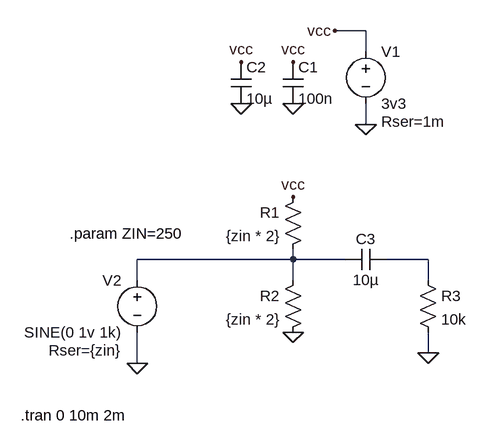
[diagram p0: schematic adc_sampling_ac_signal.asc]
adc_sampling_ac_signal.asc, the LTspice schematic file:
Version 4
SHEET 1 880 680
WIRE 288 64 240 64
WIRE 288 96 288 64
WIRE 288 208 288 176
WIRE 176 416 176 400
WIRE 176 416 -64 416
WIRE 256 416 176 416
WIRE 384 416 320 416
WIRE -64 448 -64 416
WIRE 176 448 176 416
WIRE 384 448 384 416
WIRE 384 560 384 528
WIRE -64 576 -64 528
FLAG 288 208 0
FLAG 240 64 vcc
FLAG 176 176 0
FLAG 96 176 0
FLAG 176 112 vcc
FLAG 96 112 vcc
FLAG 384 560 0
FLAG 176 320 vcc
FLAG 176 528 0
FLAG -64 576 0
SYMBOL voltage 288 80 R0
WINDOW 123 0 0 Left 0
WINDOW 39 24 124 Left 2
SYMATTR InstName V1
SYMATTR Value 3v3
SYMATTR SpiceLine Rser=1m
SYMBOL cap 160 112 R0
SYMATTR InstName C1
SYMATTR Value 100n
SYMBOL cap 80 112 R0
SYMATTR InstName C2
SYMATTR Value 10µ
SYMBOL res 192 304 M0
SYMATTR InstName R1
SYMATTR Value {zin * 2}
SYMBOL cap 320 400 R90
WINDOW 0 0 32 VBottom 2
WINDOW 3 32 32 VTop 2
SYMATTR InstName C3
SYMATTR Value 10µ
SYMBOL res 368 432 R0
SYMATTR InstName R3
SYMATTR Value 10k
SYMBOL res 192 432 M0
SYMATTR InstName R2
SYMATTR Value {zin * 2}
SYMBOL voltage -64 432 M0
WINDOW 123 0 0 Left 0
WINDOW 39 24 124 Left 2
SYMATTR InstName V2
SYMATTR Value SINE(0 1v 1k)
SYMATTR SpiceLine Rser={zin}
TEXT -168 376 Left 2 !.param ZIN=250
TEXT -80 656 Right 2 !.tran 0 10m 2m

The netlist it stands for:
* adc_sampling_ac_signal.asc
V1 vcc 0 3v3 Rser=1m
C1 vcc 0 100n
C2 vcc 0 10µ
R1 vcc N001 {zin * 2}
C3 N002 N001 10µ
R3 N002 0 10k
R2 N001 0 {zin * 2}
V2 N001 0 SINE(0 1v 1k) Rser={zin}
.param ZIN=250
.tran 0 10m 2m
.backanno
.end